# EAGLE design abernode (EAGLE 7.2.0)
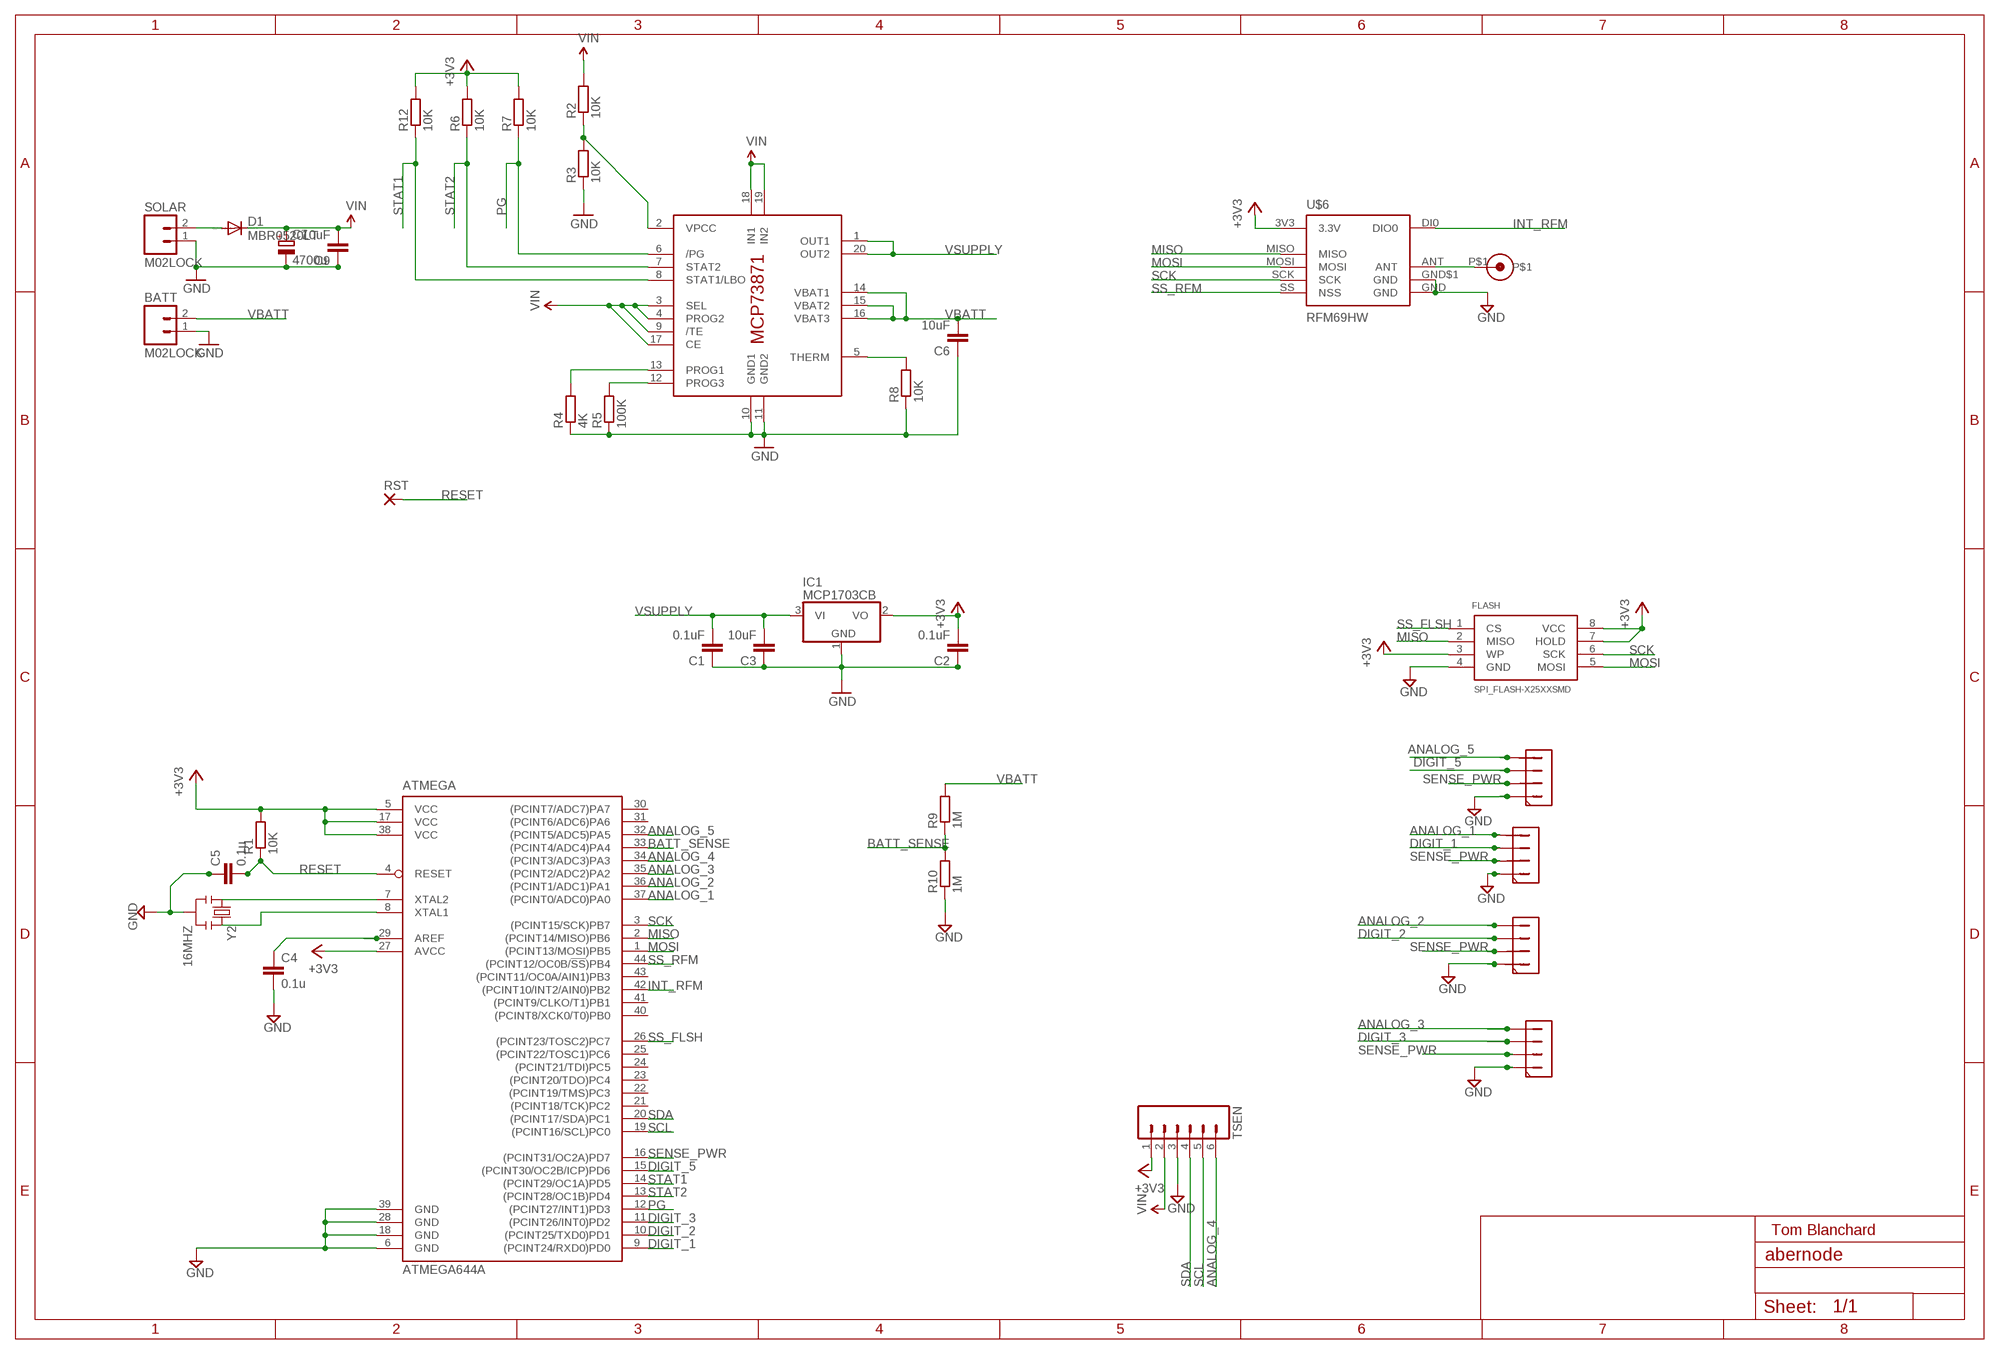
[diagram p0: schematic, sheet 1]

## Parts
ATMEGA  ATMEGA644A  [TQFP44]
BATT  M02LOCK  [1X02_LOCK]
C1  0.1uF  C-EUC0603  [C0603]
C2  0.1uF  C-EUC0603  [C0603]
C3  10uF  C-EUC0805  [C0805]
C4  0.1u  C-EUC0603  [C0603]
C5  0.1u  C-EUC0603  [C0603]
C6  10uF  C-EUC0805  [C0805]
C7  4700u  CPOL-EUE7.5-18  [E7,5-18]
C9  10uF  C-EUC0805  [C0805]
D1  MBR0520LT  [SOD123]
FLASH  SPI_FLASH-X25XXSMD  [SO08]
IC1  MCP1703CB  [SOT23]
IC2  MCP73871  [QFN20]
R1  10K  R-EU_R0603  [R0603]
R2  10K  R-EU_R0603  [R0603]
R3  10K  R-EU_R0603  [R0603]
R4  4K  R-EU_R0603  [R0603]
R5  100K  R-EU_R0603  [R0603]
R6  10K  R-EU_R0603  [R0603]
R7  10K  R-EU_R0603  [R0603]
R8  10K  R-EU_R0603  [R0603]
R9  1M  R-EU_R0603  [R0603]
R10  1M  R-EU_R0603  [R0603]
R12  10K  R-EU_R0603  [R0603]
RST  SMD2  [SMD1,27-2,54]
SEN1  HEADER_4  [HEADER_4]
SEN2  HEADER_4  [HEADER_4]
SEN3  HEADER_4  [HEADER_4]
SEN4  HEADER_4  [HEADER_4]
SOLAR  M02LOCK  [1X02_LOCK]
TSEN  M06LONGPADS  [1X06_LONGPADS]
U$6  RFM69HW  [RFM69W-XXXS2]
U$7  ANT  [ANT]
Y2  16MHZ  RESONATOR16MHZ  [RESONATOR-SMD]

## Nets
+3V3: ATMEGA.5(VCC) ATMEGA.17(VCC) ATMEGA.27(AVCC) ATMEGA.38(VCC) C2.2 FLASH.3(WP) FLASH.7(HOLD) FLASH.8(VCC) IC1.2(VO) R1.2 R6.2 R7.2 R12.2 TSEN.1 U$6.3V3(3.3V)
ANALOG_1: ATMEGA.37((PCINT0/ADC0)PA0) SEN2.4
ANALOG_2: ATMEGA.36((PCINT1/ADC1)PA1) SEN1.4
ANALOG_3: ATMEGA.35((PCINT2/ADC2)PA2) SEN4.4
ANALOG_4: ATMEGA.34((PCINT3/ADC3)PA3) TSEN.6
ANALOG_5: ATMEGA.32((PCINT5/ADC5)PA5) SEN3.4
BATT_SENSE: ATMEGA.33((PCINT4/ADC4)PA4) R9.1 R10.2
DIGIT_1: ATMEGA.9((PCINT24/RXD0)PD0) SEN2.3
DIGIT_2: ATMEGA.10((PCINT25/TXD0)PD1) SEN1.3
DIGIT_3: ATMEGA.11((PCINT26/INT0)PD2) SEN4.3
DIGIT_5: ATMEGA.15((PCINT30/OC2B/ICP)PD6) SEN3.3
GND: ATMEGA.6(GND) ATMEGA.18(GND) ATMEGA.28(GND) ATMEGA.39(GND) BATT.1 C1.1 C2.1 C3.1 C4.2 C5.1 C6.1 C7.- C9.1 FLASH.4(GND) IC1.1(GND) IC2.10(GND1) IC2.11(GND2) R3.1 R4.1 R5.1 R8.1 R10.1 SEN1.1 SEN2.1 SEN3.1 SEN4.1 SOLAR.1 TSEN.3 U$6.GND U$6.GND$1(GND) Y2.2
INT_RFM: ATMEGA.42((PCINT10/INT2/AIN0)PB2) U$6.DI0(DIO0)
MISO: ATMEGA.2((PCINT14/MISO)PB6) FLASH.2(MISO) U$6.MISO
MOSI: ATMEGA.1((PCINT13/MOSI)PB5) FLASH.5(MOSI) U$6.MOSI
N$1: ATMEGA.8(XTAL1) Y2.3
N$2: ATMEGA.7(XTAL2) Y2.1
N$3: ATMEGA.29(AREF) C4.1
N$5: IC2.12(PROG3) R5.2
N$6: IC2.2(VPCC) R2.1 R3.2
N$7: IC2.13(PROG1) R4.2
N$12: U$6.ANT U$7.P$1
N$14: D1.A SOLAR.2
N$17: IC2.5(THERM) R8.2
PG: ATMEGA.12((PCINT27/INT1)PD3) IC2.6(/PG) R7.1
RESET: ATMEGA.4(RESET) C5.2 R1.1 RST.1(P)
SCK: ATMEGA.3((PCINT15/SCK)PB7) FLASH.6(SCK) U$6.SCK
SCL: ATMEGA.19((PCINT16/SCL)PC0) TSEN.5
SDA: ATMEGA.20((PCINT17/SDA)PC1) TSEN.4
SENSE_PWR: ATMEGA.16((PCINT31/OC2A)PD7) SEN1.2 SEN2.2 SEN3.2 SEN4.2
SS_FLSH: ATMEGA.26((PCINT23/TOSC2)PC7) FLASH.1(CS)
SS_RFM: ATMEGA.44((PCINT12/OC0B/!SS!)PB4) U$6.SS(NSS)
STAT1: ATMEGA.14((PCINT29/OC1A)PD5) IC2.8(STAT1/LBO) R12.1
STAT2: ATMEGA.13((PCINT28/OC1B)PD4) IC2.7(STAT2) R6.1
VBATT: BATT.2 C6.2 IC2.14(VBAT1) IC2.15(VBAT2) IC2.16(VBAT3) R9.2
VIN: C7.+ C9.2 D1.C IC2.3(SEL) IC2.4(PROG2) IC2.9(/TE) IC2.17(CE) IC2.18(IN1) IC2.19(IN2) R2.2 TSEN.2
VSUPPLY: C1.2 C3.2 IC1.3(VI) IC2.1(OUT1) IC2.20(OUT2)
Unconnected: ATMEGA.21((PCINT18/TCK)PC2) ATMEGA.22((PCINT19/TMS)PC3) ATMEGA.23((PCINT20/TDO)PC4) ATMEGA.24((PCINT21/TDI)PC5) ATMEGA.25((PCINT22/TOSC1)PC6) ATMEGA.30((PCINT7/ADC7)PA7) ATMEGA.31((PCINT6/ADC6)PA6) ATMEGA.40((PCINT8/XCK0/T0)PB0) ATMEGA.41((PCINT9/CLKO/T1)PB1) ATMEGA.43((PCINT11/OC0A/AIN1)PB3)

## Notes on the sheet
- Tom Blanchard

## Library data of the parts
ATMEGA = atmel:ATMEGA644: 8-bit Microcontroller with 64K Bytes In-System Programmable Flash Source: http://www.atmel.com/dyn/resources/prod_documents/doc2593.pdf; MPN: ATMEGA644PV-10AU; OC_FARNELL: 1455123; OC_NEWARK: 58M3748
BATT SOLAR = SparkFun-Connectors:M02: Standard 2-pin 0.1" header. Use with - straight break away headers ( PRT-00116) - right angle break away headers (PRT-00553) - swiss pins (PRT-00743) - machine pins (PRT-00117) - female headers (PRT-00115) Molex polarized connector foot print use with: PRT-08233 with associated crimp pins and housings. 2.54_SCREWTERM for use with PRT-10571. 3.5mm Screw Terminal footprints for PRT-08084 5mm Screw Terminal footprints for use with PRT-08432
C1-C6 C9 = resistor:C-EU: CAPACITOR, European symbol
C7 = resistor:CPOL-EU: POLARIZED CAPACITOR, European symbol
D1 = diode:MBR0520LT: SCHOTTKY BARRIER RECTIFIER Source: http://onsemi.com .. MBR0520LT1-D.pdf
FLASH = SparkFun-DigitalIC:SPI_FLASH-X25XX: 8pin SPI Flash series x25xx. Works with devices like W25X32 and BR25L32
IC1 = linear:MCP1703: 250 mA, 16V, Low Quiescent Current LDO Regulator Source: http://ww1.microchip.com/downloads/en/DeviceDoc/22049b.pdf
IC2 = adafruit:MCP73871
R1-R10 R12 = resistor:R-EU_: RESISTOR, European symbol
RST = wirepad:SMD2: SMD PAD
SEN1-SEN4 = tom:HEADER_4
TSEN = SparkFun-Connectors:M06: Header 6 Standard 6-pin 0.1" header. Use with straight break away headers (SKU : PRT-00116), right angle break away headers (PRT-00553), swiss pins (PRT-00743), machine pins (PRT-00117), and female headers (PRT-00115). Molex polarized connector foot print use with SKU : PRT-08094 with associated crimp pins and housings. NOTES ON THE VARIANTS LOCK and LOCK_LONGPADS... This footprint was designed to help hold the alignment of a through-hole component (i.e. 6-pin header) while soldering it into place. You may notice that each hole has been shifted either up or down by 0.005 of an inch from it's more standard position (which is a perfectly straight line). This slight alteration caused the pins (the squares in the middle) to touch the edges of the holes. Because they are alternating, it causes a "brace" to hold the component in place. 0.005 has proven to be the perfect amount of "off-center" position when using our standard breakaway headers. Although looks a little odd when you look at the bare footprint, once you have a header in there, the alteration is very hard to notice. Also,if you push a header all the way into place, it is covered up entirely on the bottom side. This idea of altering the position of holes to aid alignment will be further integrated into the Sparkfun Library for other footprints. It can help hold any component with 3 or more connection pins.
U$6 = tom:RFM69HW
U$7 = tom:ANT
Y2 = SparkFun-FreqCtrl:RESONATOR: Resonator Small SMD resonator. Used, eg, on the Arduino Pro/ Pro Mini boards. 8MHz- XTAL-08895 16MHz- XTAL-08900; PROD_ID: XTAL-08900

## Net classes
0 default: width 0.254 mm, clearance 0.2 mm
1 PW: width 0.406 mm

## Board
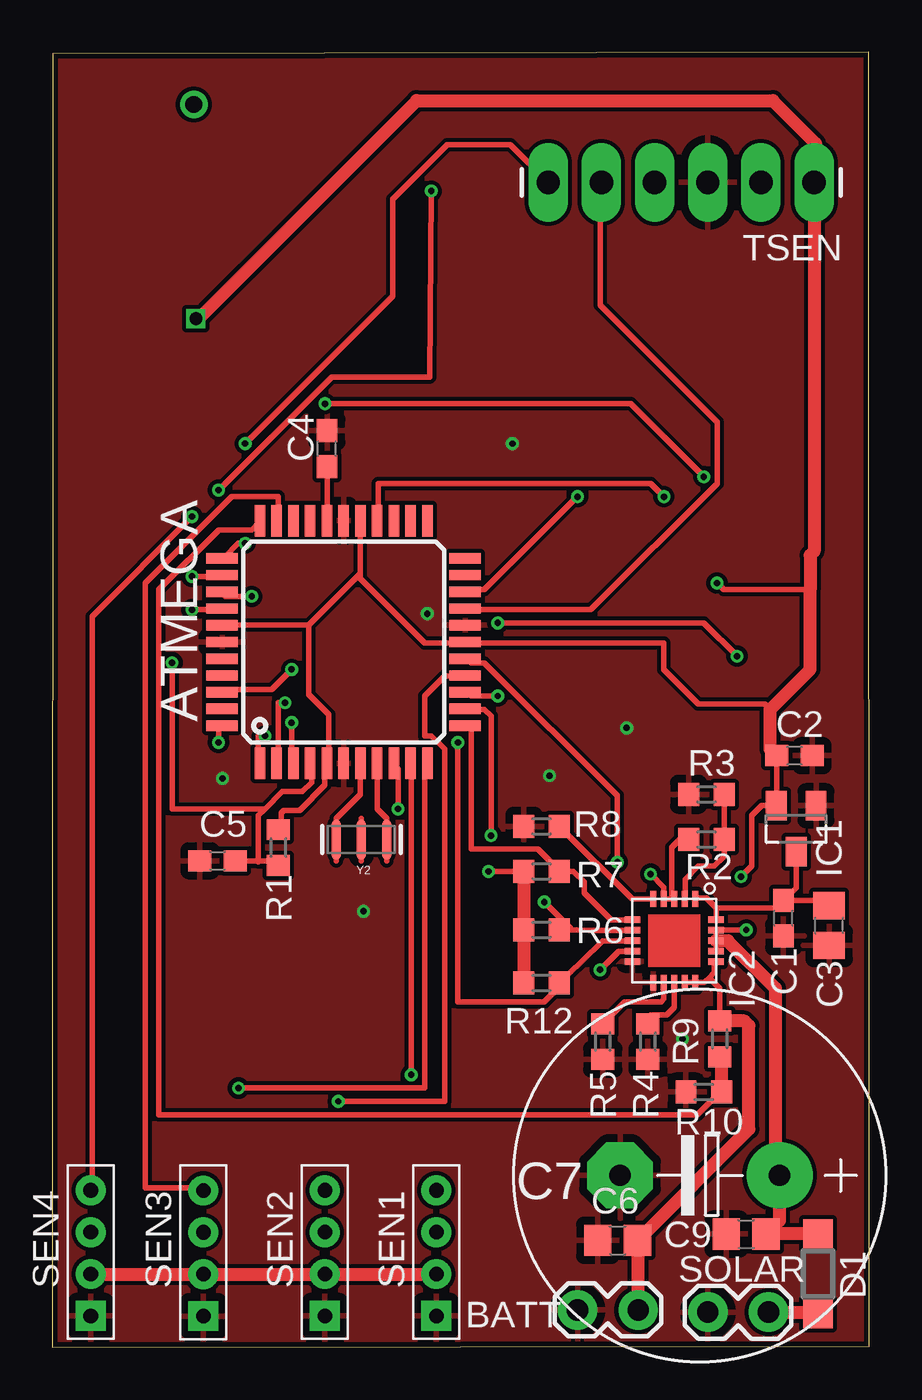
[diagram p1: board, top side]
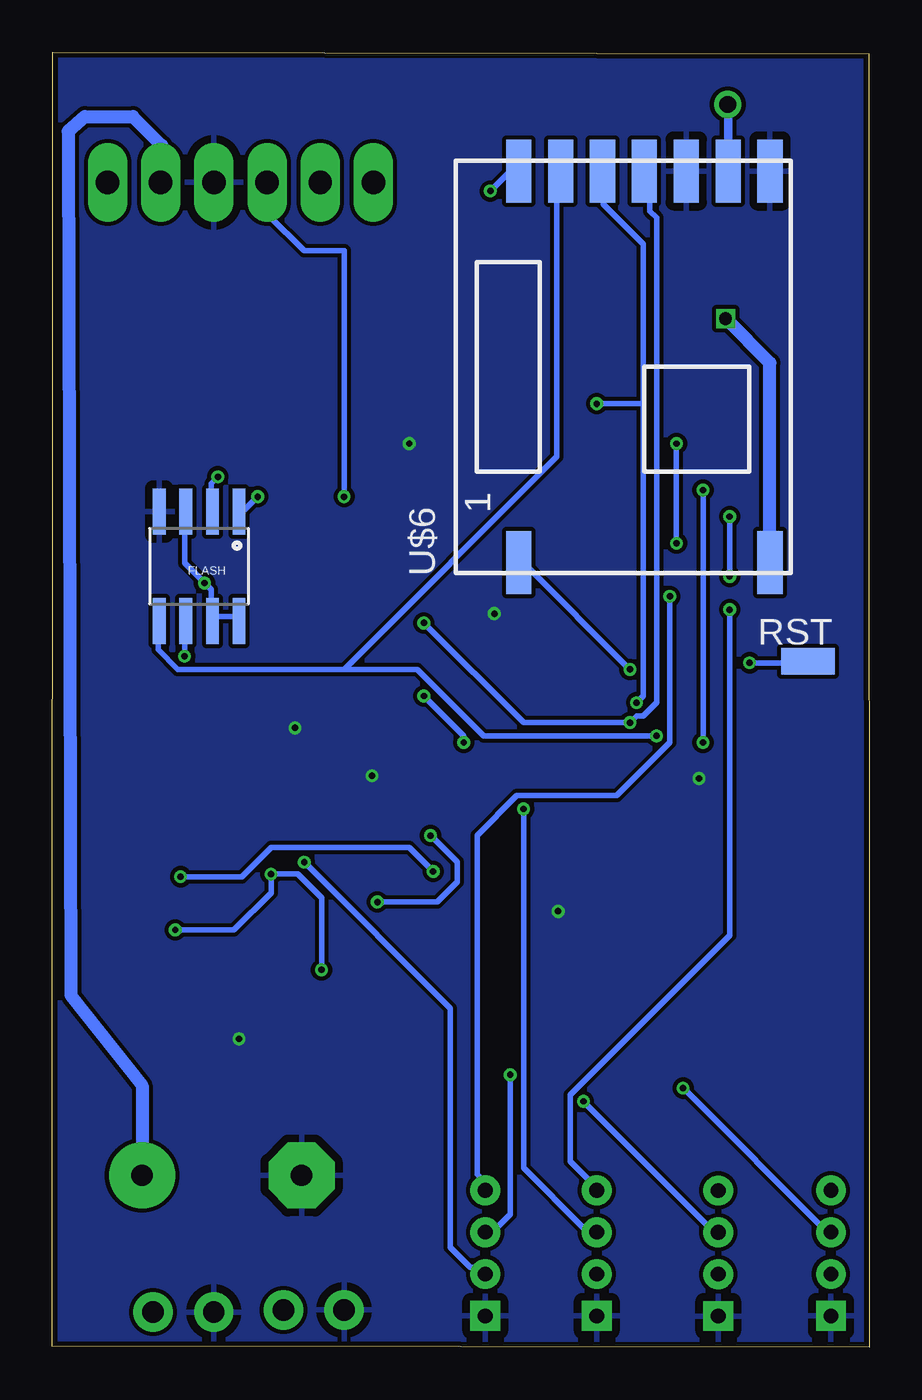
[diagram p2: board, bottom side, seen from below]

Size 39.02 x 61.87 mm. Coordinates in mm from the lower left corner, seen from the top.
Outline: 0,0 39.02,0.04 39,61.87 0.03,61.81 0,0
Copper layers (1*16): Top 0.035mm / dielectric 1.5mm / Bottom 0.035mm
Design rules "ITEADstudio_DRC": minimum track width 6mil, minimum drill 12mil, track to track 6mil, track to pad 6mil, pad to pad 6mil, via to via 6mil, smd to smd 0mil, copper to edge 10mil, drill to drill 10mil, minimum pad ring 10mil, minimum via ring 6mil, stop-mask expansion 2mil, vias tented up to drill 100mil, thermal gap 15mil

### Footprints (pad centres in the part's own frame; a part is rotated, then mirrored left to right if it is on the bottom)
TQFP44 = smd 1.5 x 0.5: 1 -5.8,4; 2 -5.8,3.2; 3 -5.8,2.4; 4 -5.8,1.6; 5 -5.8,0.8; 6 -5.8,0; 7 -5.8,-0.8; 8 -5.8,-1.6; 9 -5.8,-2.4; 10 -5.8,-3.2; 11 -5.8,-4; 23 5.8,-4; 24 5.8,-3.2; 25 5.8,-2.4; 26 5.8,-1.6; 27 5.8,-0.8; 28 5.8,0; 29 5.8,0.8; 30 5.8,1.6; 31 5.8,2.4; 32 5.8,3.2; 33 5.8,4 | smd 0.5 x 1.5: 12 -4,-5.8; 13 -3.2,-5.8; 14 -2.4,-5.8; 15 -1.6,-5.8; 16 -0.8,-5.8; 17 0,-5.8; 18 0.8,-5.8; 19 1.6,-5.8; 20 2.4,-5.8; 21 3.2,-5.8; 22 4,-5.8; 34 4,5.8; 35 3.2,5.8; 36 2.4,5.8; 37 1.6,5.8; 38 0.8,5.8; 39 0,5.8; 40 -0.8,5.8; 41 -1.6,5.8; 42 -2.4,5.8; 43 -3.2,5.8; 44 -4,5.8
1X02_LOCK = drill 1.016 pad 1.88: 1 -0.178,0; 2 2.718,0
C0603 = smd 1.1 x 1: 1 -0.85,0; 2 0.85,0
C0805 = smd 1.3 x 1.5: 1 -0.95,0; 2 0.95,0
E7,5-18 = drill 1.016 pad 3.15: + -3.81,0 | drill 1.016 pad 3.15 octagon: - 3.81,0
SOD123 = smd 1.4 x 1.4: A 1.9,0; C -1.9,0
SO08 = smd 0.61 x 2.21: 1 -1.905,-2.616; 2 -0.635,-2.616; 3 0.635,-2.616; 4 1.905,-2.616; 5 1.905,2.616; 6 0.635,2.616; 7 -0.635,2.616; 8 -1.905,2.616
SOT23 = smd 1 x 1.4: 1 -0.95,-1.1; 2 0.95,-1.1; 3 0,1.1
QFN20 = smd 0.75 x 0.3: 1 -2,1; 2 -2,0.5; 3 -2,0; 4 -2,-0.5; 5 -2,-1; 11 2,-1; 12 2,-0.5; 13 2,0; 14 2,0.5; 15 2,1 | smd 0.3 x 0.75: 6 -1,-2; 7 -0.5,-2; 8 0,-2; 9 0.5,-2; 10 1,-2; 16 1,2; 17 0.5,2; 18 0,2; 19 -0.5,2; 20 -1,2
R0603 = smd 1 x 1.1: 1 -0.85,0; 2 0.85,0
SMD1,27-2,54 = smd 1.27 x 2.54: 1 0,0
HEADER_4 = drill 0.7 pad 1.422 square: 1 0,3 | drill 0.7 pad 1.422: 2 0,1; 3 0,-1; 4 0,-3
1X06_LONGPADS = drill 1.118 pad 1.88 long: 1 0,0; 2 2.54,0; 3 5.08,0; 4 7.62,0; 5 10.16,0; 6 12.7,0
RFM69W-XXXS2 = smd 3 x 1.2: 3V3 -9.35,-7; ANT 9.35,-5; DI0 -9.35,5; GND 9.35,-3; GND$1 9.35,-7; MISO 9.35,1; MOSI 9.35,3; SCK 9.35,-1; SS 9.35,5
ANT = drill 0.8: P$1 0,0
RESONATOR-SMD = smd 0.45 x 1.905: 1 -1.2,0; 2 0,0; 3 1.2,0

### Placement (x,y rotation side)
ATMEGA  13.91,33.7 90 top
BATT  25.27,1.78 0 top
C1  34.92,20.5 90 top
C2  35.45,28.27 180 top
C3  37.1,20.14 90 top
C4  13.12,42.94 90 top
C5  7.89,23.24 0 top
C6  27,5.11 0 top
C7  30.93,8.21 180 top
C9  33.14,5.41 0 top
D1  36.58,3.51 270 top
FLASH  32.01,37.32 180 bottom
IC1  35.53,24.77 180 top
IC2  29.71,19.42 270 top
R1  10.8,23.88 90 top
R2  31.24,24.26 180 top
R3  31.24,26.42 0 top
R4  28.45,14.61 90 top
R5  26.29,14.61 90 top
R6  23.37,19.94 180 top
R7  23.37,22.73 180 top
R8  23.37,24.89 0 top
R9  31.88,14.73 90 top
R10  31.12,12.19 0 top
R12  23.37,17.4 180 top
RST  2.92,32.77 270 bottom
SEN1  18.34,4.49 180 top
SEN2  13.02,4.49 180 top
SEN3  7.21,4.49 180 top
SEN4  1.83,4.49 180 top
SOLAR  31.49,1.67 0 top
TSEN  36.39,55.66 180 top
U$6  11.74,46.85 90 bottom
U$7  6.76,59.38 0 top
Y2  14.76,24.25 0 top

### Tracks (layer width: path | path; a pad name or v marks a point on that pad's centre or on a via)
+3V3  (via drill 0.3, 0.3 pad 0.25, 0.6)
  Top 0.254: v32.89,22.48 33.4,22.99 33.4,25.4 33.88,25.87 IC1.2 34.6,25.89 C2.2 34.29,28.57 | R7.2 v20.83,22.73 20.7,22.86 | ATMEGA.27 14.71,36.96 | 14.71,36.96 14.71,36.72 17.78,33.66 19.67,33.66 ATMEGA.17 20,33.66 29.21,33.66 29.21,32.39 30.86,30.73 34.04,30.73 34.29,30.48 | ATMEGA.38 12.25,34.5 | 12.25,34.5 14.71,36.96 | 12.25,34.5 12.25,31.18 13.21,30.23 13.21,27.99 ATMEGA.5 13.02,27.62 13.02,26.86 11.81,25.65 11.05,25.65 10.92,25.53 10.92,24.85 R1.2 10.8,24.76 11.11,25.08 | v31.75,36.51 32.07,36.2 36.2,36.2
  Top 0.61: R7.2 R6.2 R12.2 | 34.29,28.57 34.29,30.48 36.2,32.39 36.2,36.2 36.2,37.85 36.39,38.04 TSEN.1 36.45,55.73 36.45,57.53 34.42,59.56 17.4,59.56 6.99,49.15 v6.86,49.15
  Bottom 0.254: v32.89,22.48 29.97,22.48 28.58,23.88 21.97,23.88 v20.83,22.73 | FLASH.8 30.16,34.93 31.12,34.93 FLASH.7 31.43,34.93 31.43,36.2 v31.75,36.51 32.7,37.47 32.7,39.69 FLASH.3
  Bottom 0.61: U$6.3V3 4.74,47.03 v6.86,49.15
ANALOG_1  (via drill 0.3)
  Top 0.254: v6.67,35.24 7.94,35.24 ATMEGA.37
  Bottom 0.254: v6.67,35.24 6.67,19.68 14.29,12.06 14.29,8.89 13.02,7.62 SEN2.4
ANALOG_2  (via drill 0.3)
  Top 0.254: v9.53,35.88 8.26,35.88 ATMEGA.36
  Bottom 0.254: v9.53,35.88 9.53,28.89 12.07,26.35 16.83,26.35 18.73,24.45 18.73,8.26 18.1,7.62 SEN1.4
ANALOG_3  (via drill 0.3)
  Top 0.254: v6.67,36.83 7.94,36.83 ATMEGA.35 | v6.67,39.69 1.91,34.93 1.91,7.62 SEN4.4
  Bottom 0.254: v6.67,39.69 v6.67,36.83
ANALOG_4  (via drill 0.3)
  Top 0.254: v9.21,38.42 8.89,38.42 8.26,37.78 ATMEGA.34 | v9.21,43.18 16.26,50.23 16.26,54.86 18.86,57.47 21.88,57.47 TSEN.6
  Bottom 0.254: v9.21,43.18 v9.21,38.42
ANALOG_5
  Top 0.254: ATMEGA.32 10.8,39.69 10.8,40.64 8.57,40.64 4.45,36.51 4.45,7.62 6.99,7.62 SEN3.4
BATT_SENSE
  Top 0.254: ATMEGA.33 9.85,39.37 9.53,39.05 7.94,39.05 5.08,36.2 5.08,11.11 30.8,11.11 31.75,12.06 R10.2
  Top 0.61: R10.2 31.97,13.79 R9.1
DIGIT_1  (via drill 0.3)
  Top 0.254: v16.51,25.72 16.51,27.62 ATMEGA.9
  Bottom 0.254: v16.51,25.72 16.51,8.57 13.65,5.71 13.02,5.71 SEN2.3
DIGIT_2  (via drill 0.3)
  Top 0.254: v17.15,13.02 17.15,27.62 ATMEGA.10
  Bottom 0.254: v17.15,13.02 17.15,6.35 18.1,5.4 SEN1.3
DIGIT_3  (via drill 0.3)
  Top 0.254: v8.89,12.38 17.78,12.38 17.78,27.62 ATMEGA.11
  Bottom 0.254: v8.89,12.38 1.91,5.4 SEN4.3
DIGIT_5  (via drill 0.3)
  Top 0.254: v13.65,11.75 18.73,11.75 18.73,28.57 18.1,29.21 17.78,29.21 17.78,31.11 18.73,32.07 19.69,32.07 ATMEGA.15
  Bottom 0.254: v13.65,11.75 7.3,5.4 SEN3.3
GND  (via drill 0.3 pad 0.25)
  other vias: 14.86,20.83 23.75,27.3 27.43,29.59 8.13,27.18 30.1,14.73 21.97,43.18 17.91,35.05
  pour Top: -3.17,-0.64 38.83,-0.64 38.83,66.86 -3.17,66.86
  pour Bottom: -3.17,-0.64 38.73,-0.64 38.73,66.46 -3.17,66.46
INT_RFM  (via drill 0.3)
  Top 0.254: v11.43,32.39 10.48,31.43 8.26,31.43 ATMEGA.42
  Bottom 0.254: v11.43,32.39 16.51,37.47 U$6.DI0
MISO  (via drill 0.3)
  Top 0.254: v11.11,30.8 10.8,30.8 10.8,27.94 ATMEGA.2 | v31.12,41.59 27.62,45.09 v13.02,45.09
  Bottom 0.254: v11.11,30.8 10.8,31.11 10.8,45.09 | 10.8,45.09 10.8,52.71 12.7,54.61 12.7,56.2 U$6.MISO | v31.12,41.59 31.43,41.27 31.43,40.01 FLASH.2 | 10.8,45.09 v13.02,45.09
MOSI  (via drill 0.3)
  Top 0.254: v10.16,29.21 9.85,29.21 9.85,27.94 ATMEGA.1
  Bottom 0.254: v10.16,29.21 18.42,29.21 21.59,32.39 25.09,32.39 | 25.09,32.39 33.02,32.39 33.98,33.34 33.98,34.61 FLASH.5 | 25.09,32.39 14.92,42.55 14.92,56.2 U$6.MOSI
N$1
  Top 0.254: ATMEGA.8 15.51,25.72 15.96,25.27
N$2
  Top 0.254: ATMEGA.7 14.71,26.42 13.56,25.27
N$3
  Top 0.254: C4.1 ATMEGA.29
N$5
  Top 0.254: R5.2 27.35,16.51 29.09,16.51 29.21,16.63 IC2.12
N$6
  Top 0.254: R3.2 R2.1 32.09,23.46 31.62,22.99 30.86,22.99 30.23,22.35 30.23,21.44 IC2.2
N$7
  Top 0.254: R4.2 28.31,15.59 28.59,15.88 29.34,15.88 29.71,16.24 IC2.13
N$12
  Bottom 0.406: U$6.ANT 6.74,59.36 U$7.P$1
N$14
  Top 0.61: SOLAR.2 36.51,1.67 D1.A
N$17
  Top 0.254: R8.2 27.69,21.42 IC2.5
PG
  Top 0.254: IC2.6 26.7,20.42 25.4,21.72 25.4,22.22 24.89,22.73 R7.1 24.13,22.86 23.18,23.81 20,23.81 20,29.53 ATMEGA.12
RESET  (via drill 0.3)
  Top 0.254: C5.2 9.85,23.24 | 9.85,23.24 10.58,23.24 R1.1 | 10.16,25.72 9.85,25.4 9.85,23.24 | ATMEGA.4 12.38,27.62 12.38,26.99 11.94,26.54 10.99,26.54 10.16,25.72 | 9.85,23.18 9.85,23.24 | v5.72,32.7 5.72,25.72 10.16,25.72
  Bottom 0.254: v5.72,32.7 3.56,32.7 RST.1
SCK  (via drill 0.3)
  Top 0.254: v11.43,29.84 11.43,27.94 ATMEGA.3 | v32.7,33.02 31.12,34.61 v21.27,34.61
  Bottom 0.254: U$6.SCK 10.48,56.2 10.48,54.29 10.16,53.98 10.16,30.8 10.8,30.16 11.11,30.16 v11.43,29.84 16.51,29.84 v21.27,34.61 | v32.7,33.02 32.7,34.61 FLASH.6
SCL
  Top 0.254: ATMEGA.19 20,35.24 25.72,35.24 31.75,41.27 31.75,44.2 26.16,49.78 26.16,55.6 TSEN.5
SDA  (via drill 0.3)
  Top 0.254: v25.09,40.64 20.64,36.2 20,36.2 ATMEGA.20
  Bottom 0.254: v25.09,40.64 25.09,52.39 26.99,52.39 28.7,54.1 28.7,55.6 TSEN.4
SENSE_PWR  (via drill 0.3)
  Top 0.254: v26.99,23.18 26.99,26.35 20.64,32.7 20,32.7 ATMEGA.16
  Top 0.61: SEN4.2 SEN3.2 SEN2.2 SEN1.2
  Bottom 0.254: v26.99,23.18 20,16.19 20,4.76 19.05,3.81 18.42,3.81 SEN1.2
SS_FLSH  (via drill 0.3)
  Top 0.254: v29.21,40.64 28.58,41.27 15.56,41.27 15.56,39.69 ATMEGA.26
  Bottom 0.254: v29.21,40.64 29.85,40.01 FLASH.1
SS_RFM  (via drill 0.3)
  Top 0.254: v7.94,28.89 7.94,29.53 ATMEGA.44 | v7.94,40.96 13.34,46.36 18.04,46.36 v18.1,55.25
  Bottom 0.254: v7.94,40.96 v7.94,28.89 | v18.1,55.25 16.83,56.52 U$6.SS
STAT1  (via drill 0.3)
  Top 0.254: IC2.8 26.28,19.42 25.27,18.41 R12.1 24.13,17.14 23.5,16.51 19.37,16.51 v19.37,28.89 | v21.27,31.11 20,31.11 ATMEGA.14
  Bottom 0.254: v21.27,31.11 19.37,29.21 v19.37,28.89
STAT2  (via drill 0.3)
  Top 0.254: IC2.7 25.67,19.92 25.02,19.94 24.77,19.94 | 24.77,19.94 R6.1 | v20.96,24.45 20.96,30.16 20.64,30.48 20,30.48 ATMEGA.13 | v23.5,21.27 24.77,20 24.77,19.94
  Bottom 0.254: v20.96,24.45 19.69,23.18 19.69,22.22 20.64,21.27 v23.5,21.27
VBATT
  Top 0.254: IC2.14 IC2.15 31.14,17.42 31.37,17.65 | 31.37,17.65 31.62,17.91 31.62,18.34 IC2.16 | R9.2 31.88,17.14 31.37,17.65
  Top 0.61: BATT.2 27.98,5.08 C6.2 33.28,10.43 33.28,15.37 33.06,15.58 R9.2
VIN  (via drill 0.3 pad 0.25)
  Top 0.254: IC2.17 IC2.18 IC2.19 31.72,19.94 v33.15,19.94 | R2.2 29.97,24.26 29.59,23.88 29.59,21.54 IC2.3 IC2.4 29.21,21.97 v28.58,22.61 | IC2.9 27.05,18.92 v26.16,18.03
  Top 0.61: D1.C C9.2 | C9.2 | C9.2 34.74,6.06 C7.+ 34.55,8.4 34.55,17.14 32.27,19.42 IC2.18
  Bottom 0.254: v26.16,18.03 26.16,21.46 27.31,22.61 v28.58,22.61 28.58,21.72 30.35,19.94 v33.15,19.94
  Bottom 0.61: C7.+ 34.74,12.51 38.14,16.81 38.26,58.1 37.47,58.8 35.17,58.8 33.79,57.42 | TSEN.2 33.79,57.42 | 33.79,57.42 33.91,57.5
VSUPPLY
  Top 0.254: IC2.1 30.75,21.46 31.24,21.46 31.71,21 | 31.71,21 IC2.20 | C1.2 34.57,21 31.71,21 | C3.2 36.85,21.35 C1.2 | C1.2 35.53,21.95 IC1.3